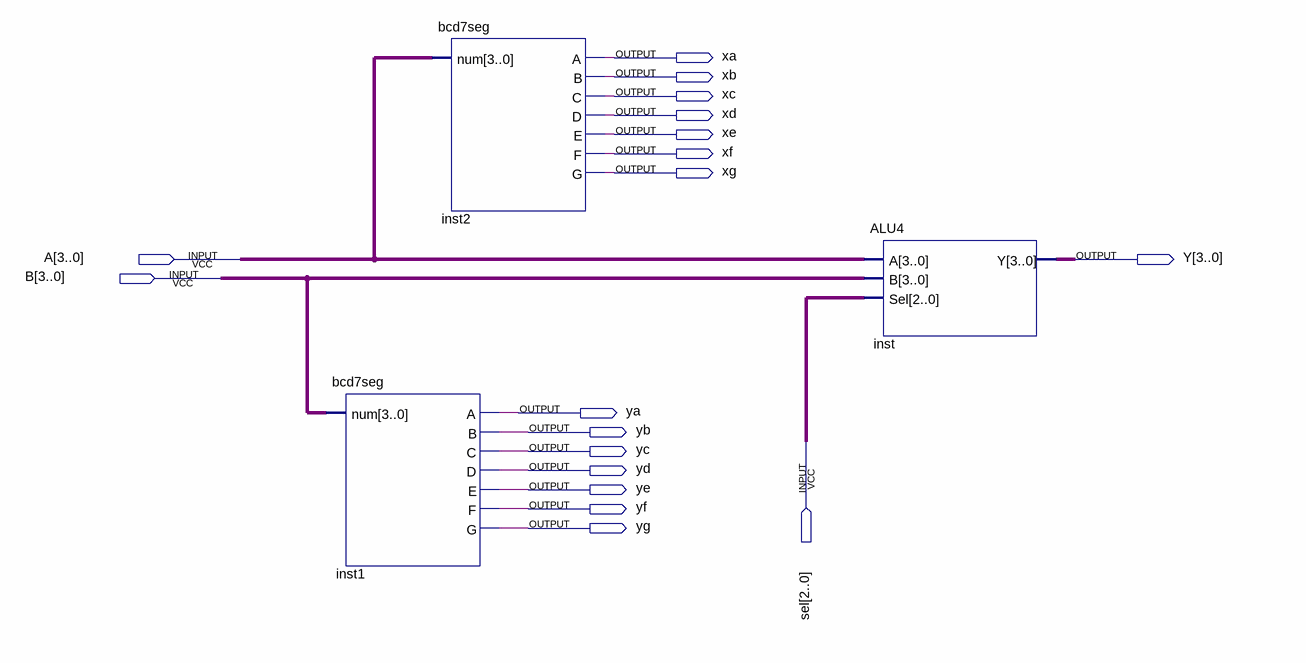
[diagram p0: schematic sheet]
// Quartus schematic alu_bcd.bdf as structural Verilog: 3 symbols, 18 pins
module alu_bcd (
  input  [3:0] A,
  input  [3:0] B,
  input  [2:0] sel,
  output xa,
  output xb,
  output xc,
  output xd,
  output xe,
  output xf,
  output xg,
  output [3:0] Y,
  output ya,
  output yb,
  output yc,
  output yd,
  output ye,
  output yf,
  output yg
);

  bcd7seg inst1 (.num(B), .A(ya), .B(yb), .C(yc), .D(yd), .E(ye), .F(yf), .G(yg));
  bcd7seg inst2 (.num(A), .A(xa), .B(xb), .C(xc), .D(xd), .E(xe), .F(xf), .G(xg));
  ALU4 inst (.A(A), .B(B), .Sel(sel), .Y(Y));
endmodule
